# EAGLE design AD725_NTSC_Encoder (EAGLE 5.08)
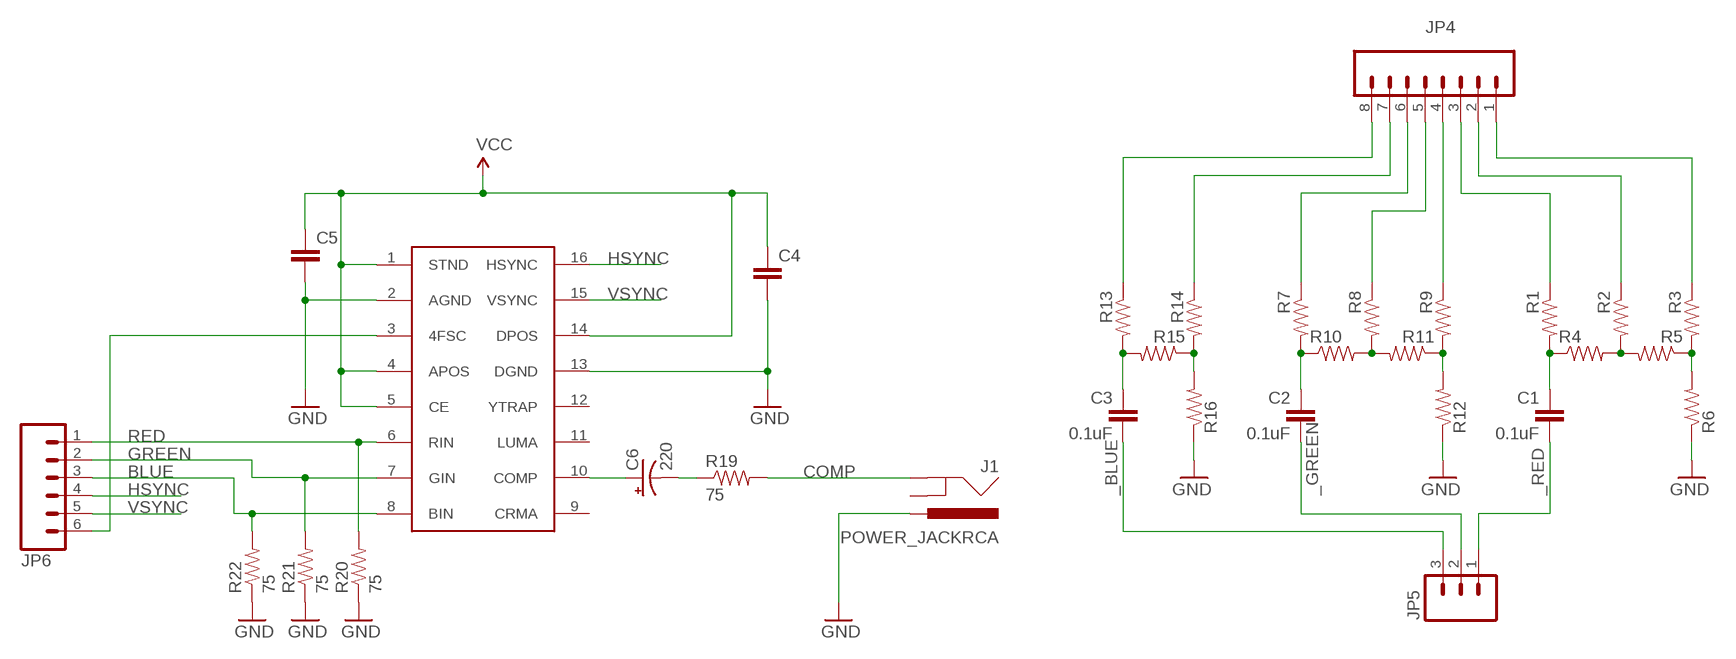
[diagram p0: schematic, sheet 1]

## Parts
C1  0.1uF  CAP0805  [0805]
C2  0.1uF  CAP0805  [0805]
C3  0.1uF  CAP0805  [0805]
C4  CAP0805  [0805]
C5  CAP0805  [0805]
C6  220  CAP_POLPTH1  [CPOL-RADIAL-100UF-25V]
J1  POWER_JACKRCA  [RCA]
JP4  M08  [1X08]
JP5  M03PTH  [1X03]
JP6  M06SIP  [1X06]
R1  RESISTOR1206  [1206]
R2  RESISTOR1206  [1206]
R3  RESISTOR1206  [1206]
R4  RESISTOR1206  [1206]
R5  RESISTOR1206  [1206]
R6  RESISTOR1206  [1206]
R7  RESISTOR1206  [1206]
R8  RESISTOR1206  [1206]
R9  RESISTOR1206  [1206]
R10  RESISTOR1206  [1206]
R11  RESISTOR1206  [1206]
R12  RESISTOR1206  [1206]
R13  RESISTOR1206  [1206]
R14  RESISTOR1206  [1206]
R15  RESISTOR1206  [1206]
R16  RESISTOR1206  [1206]
R19  75  RESISTOR1206  [1206]
R20  75  RESISTOR1206  [1206]
R21  75  RESISTOR1206  [1206]
R22  75  RESISTOR1206  [1206]
U$3  AD725  [SO16W]

## Nets
_BLUE: C3.2 JP5.3
_GREEN: C2.2 JP5.2
_RED: C1.2 JP5.1
B0: JP4.7 R14.1
B1: JP4.8 R13.1
BLUE: JP6.3 R22.2 U$3.8(BIN)
COMP: J1.BARREL(GND) R19.2
G0: JP4.4 R9.1
G1: JP4.5 R8.1
G2: JP4.6 R7.1
GND: C4.2 C5.2 J1.BREAK(PWR) R6.1 R12.1 R16.1 R20.1 R21.1 R22.1 U$3.2(AGND) U$3.13(DGND)
GREEN: JP6.2 R21.2 U$3.7(GIN)
HSYNC: JP6.4 U$3.16(HSYNC)
N$1: C1.1 R1.2 R4.1
N$2: R2.2 R4.2 R5.2
N$3: R3.2 R5.1 R6.2
N$4: C2.1 R7.2 R10.1
N$5: R8.2 R10.2 R11.2
N$6: R9.2 R11.1 R12.2
N$7: C3.1 R13.2 R15.2
N$8: R14.2 R15.1 R16.2
N$9: C6.1(+) U$3.10(COMP)
N$12: C6.2(-) R19.1
N$13: JP6.6 U$3.3(4FSC)
R0: JP4.1 R3.1
R1: JP4.2 R2.1
R2: JP4.3 R1.1
RED: JP6.1 R20.2 U$3.6(RIN)
VCC: C4.1 C5.1 U$3.1(STND) U$3.4(APOS) U$3.5(CE) U$3.14(DPOS)
VSYNC: JP6.5 U$3.15(VSYNC)
Unconnected: J1.SPRING(GNDBREAK) U$3.9(CRMA) U$3.11(LUMA) U$3.12(YTRAP)

## Library data of the parts
C1-C5 = SparkFun:CAP: Capacitor Standard 0603 ceramic capacitor, and 0.1" leaded capacitor.
C6 = SparkFun:CAP_POL: Capacitor Polarized These are standard SMD and PTH capacitors. Normally 10uF, 47uF, and 100uF in electrolytic and tantalum varieties. Always verify the external diameter of the through hole cap, it varies with capacity, voltage, and manufacturer. The EIA devices should be standard.
J1 = SparkFun:POWER_JACK: Power Jack This is the standard 5.5mm barrel jack for power. The PTH is the most common, proven, reliable, footprint. All others are experimental. The Slot footprint only works if the mill layer is transmitted to the PCB fab house so be warned. Spark Fun Electronics SKU : PRT-00119. Mating wall wart : TOL-00298 (and others)
JP4 = SparkFun:M08: Header 8 Standard 8-pin 0.1" header. Use with straight break away headers (SKU : PRT-00116), right angle break away headers (PRT-00553), swiss pins (PRT-00743), machine pins (PRT-00117), and female headers (PRT-00115).
JP5 = SparkFun:M03: Header 3 Standard 3-pin 0.1" header. Use with straight break away headers (SKU : PRT-00116), right angle break away headers (PRT-00553), swiss pins (PRT-00743), machine pins (PRT-00117), and female headers (PRT-00115). Molex polarized connector foot print use with SKU : PRT-08232 with associated crimp pins and housings.
JP6 = SparkFun:M06: Header 6 Standard 6-pin 0.1" header. Use with straight break away headers (SKU : PRT-00116), right angle break away headers (PRT-00553), swiss pins (PRT-00743), machine pins (PRT-00117), and female headers (PRT-00115). Molex polarized connector foot print use with SKU : PRT-08094 with associated crimp pins and housings. NOTES ON THE VARIANTS LOCK and LOCK_LONGPADS... This footprint was designed to help hold the alignment of a through-hole component (i.e. 6-pin header) while soldering it into place. You may notice that each hole has been shifted either up or down by 0.005 of an inch from it's more standard position (which is a perfectly straight line). This slight alteration caused the pins (the squares in the middle) to touch the edges of the holes. Because they are alternating, it causes a "brace" to hold the component in place. 0.005 has proven to be the perfect amount of "off-center" position when using our standard breakaway headers. Although looks a little odd when you look at the bare footprint, once you have a header in there, the alteration is very hard to notice. Also, if you push a header all the way into place, it is covered up entirely on the bottom side. This idea of altering the position of holes to aid alignment will be further integrated into the Sparkfun Library for other footprints. It can help hold any component with 3 or more connection pins.
R1-R16 R19-R22 = SparkFun:RESISTOR: Resistor Basic schematic elements and footprints for 0603, 1206, and PTH 1/10th watt (small) resistors.
U$3 = Atari:AD725

## Board
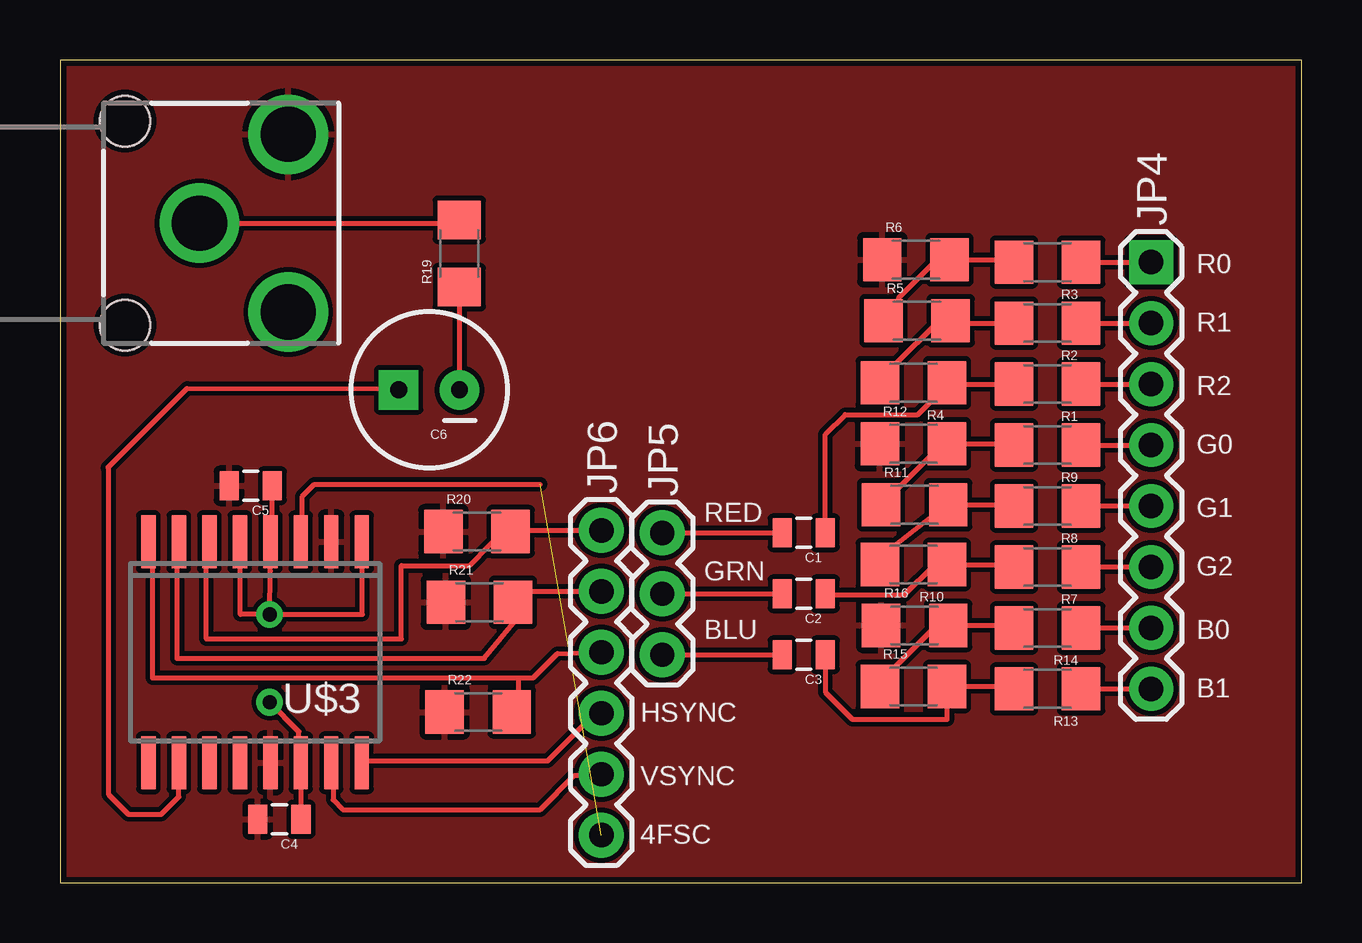
[diagram p1: board, top side]
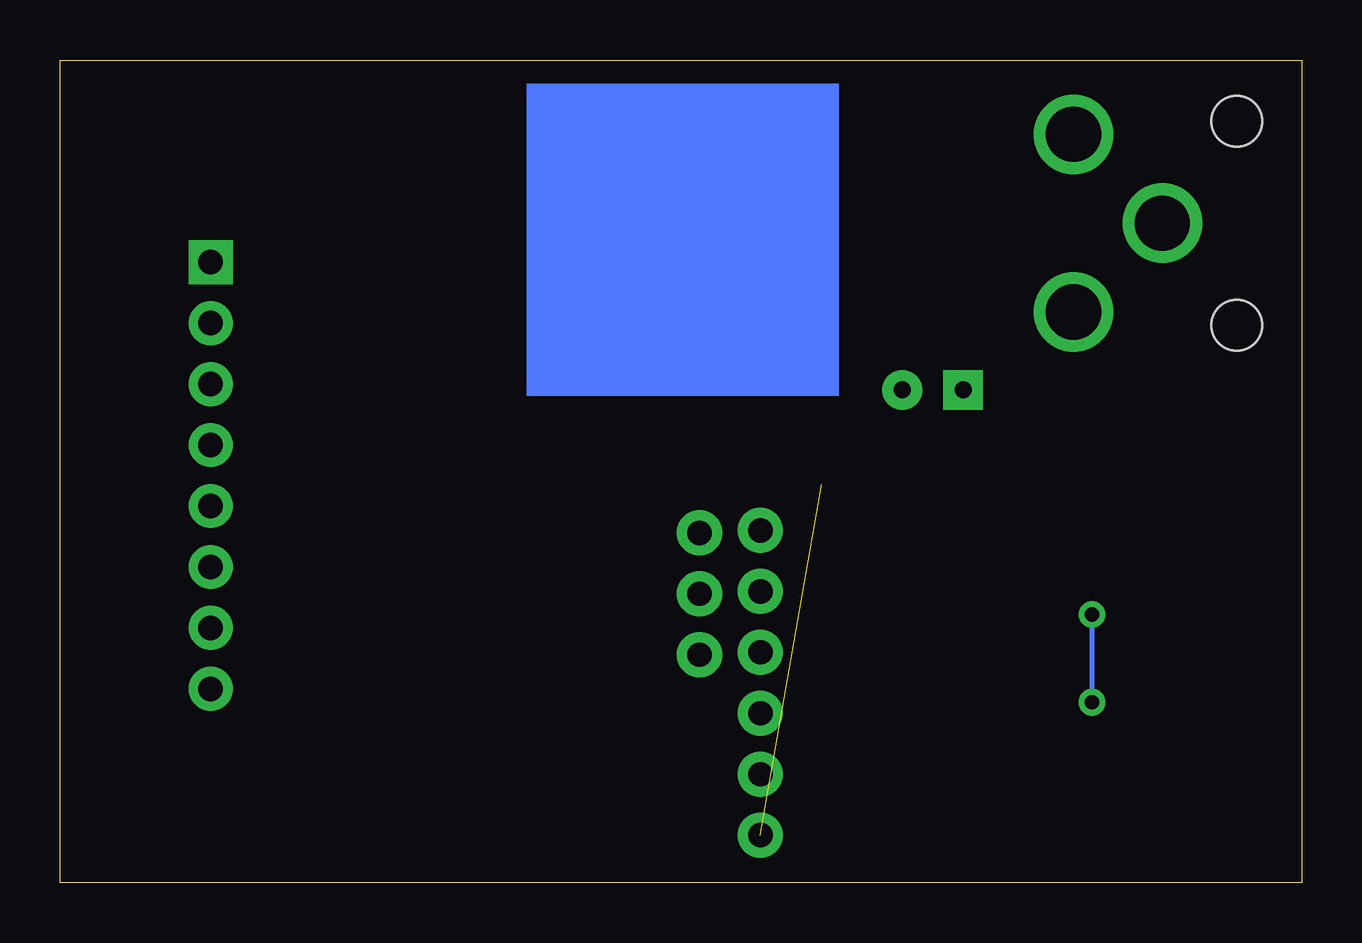
[diagram p2: board, bottom side, seen from below]

Size 51.74 x 34.28 mm. Coordinates in mm from the lower left corner, seen from the top.
Outline: 0,0 51.74,0 51.74,34.28 0,34.28 0,0
Copper layers (1*16): Top 0.035mm / dielectric 1.5mm / Bottom 0.035mm
Design rules "SparkFun": minimum track width 8mil, minimum drill 20mil, track to track 8mil, track to pad 8mil, pad to pad 8mil, via to via 8mil, smd to smd 8mil, copper to edge 10mil, drill to drill 8mil, minimum pad ring 12mil, minimum via ring 10mil, stop-mask expansion 4mil, vias tented up to drill 25mil, thermal gap 10mil

### Footprints (pad centres in the part's own frame; a part is rotated, then mirrored left to right if it is on the bottom)
0805 = smd 0.8 x 1.2: 1 -0.9,0; 2 0.9,0
CPOL-RADIAL-100UF-25V = drill 0.7 pad 1.651 square: 1 1.27,0 | drill 0.7 pad 1.651 round: 2 -1.27,0
RCA = drill 2.3 round: BARREL 0,0; BREAK 3.7,3.7; SPRING 3.7,-3.7 | hole 2.1: -3.1,4.25; -3.1,-4.25
1X08 = drill 1.016 pad 1.829 square: 1 0,0 | drill 1.016 pad 1.829 round: 2 2.54,0; 3 5.08,0; 4 7.62,0; 5 10.16,0; 6 12.7,0; 7 15.24,0; 8 17.78,0
1X03 = drill 1.016 pad 1.88 round: 1 0,0; 2 2.54,0; 3 5.08,0
1X06 = drill 1.016 pad 1.88 round: 1 0,0; 2 2.54,0; 3 5.08,0; 4 7.62,0; 5 10.16,0; 6 12.7,0
1206 = smd 1.6 x 1.8: 1 -1.4,0; 2 1.4,0
SO16W = smd 0.6 x 2.2: 1 -4.445,-4.6; 2 -3.175,-4.6; 3 -1.905,-4.6; 4 -0.635,-4.6; 5 0.635,-4.6; 6 1.905,-4.6; 7 3.175,-4.6; 8 4.445,-4.6; 9 4.445,4.6; 10 3.175,4.6; 11 1.905,4.6; 12 0.635,4.6; 13 -0.635,4.6; 14 -1.905,4.6; 15 -3.175,4.6; 16 -4.445,4.6

### Placement (x,y rotation side)
C1  30.99,14.58 180 top
C2  30.99,12.04 180 top
C3  30.99,9.5 180 top
C4  9.14,2.64 180 top
C5  7.95,16.54 180 top
C6  15.38,20.54 180 top
J1  5.81,27.48 0 top
JP4  45.47,25.86 270 top
JP5  25.1,14.58 270 top
JP6  22.56,14.68 270 top
R1  41.15,20.78 180 top
R2  41.15,23.32 180 top
R3  41.15,25.86 180 top
R4  35.56,20.83 180 top
R5  35.71,23.42 0 top
R6  35.66,25.96 0 top
R7  41.15,13.16 180 top
R8  41.15,15.7 180 top
R9  41.15,18.24 180 top
R10  35.56,13.26 180 top
R11  35.61,15.75 0 top
R12  35.56,18.29 0 top
R13  41.15,8.08 180 top
R14  41.15,10.62 180 top
R15  35.56,8.18 0 top
R16  35.61,10.72 0 top
R19  16.63,26.22 90 top
R20  17.37,14.63 0 top
R21  17.48,11.68 0 top
R22  17.42,7.11 0 top
U$3  8.13,9.6 180 top

### Tracks (layer width: path | path; a pad name or v marks a point on that pad's centre or on a via)
_BLUE
  Top 0.203: JP5.3 C3.2
_GREEN
  Top 0.203: JP5.2 C2.2
_RED
  Top 0.203: JP5.1 C1.2
B0
  Top 0.203: R14.1 JP4.7
B1
  Top 0.203: R13.1 JP4.8
BLUE
  Top 0.203: 3.86,14.22 3.86,8.53 19.1,8.53 | 19.1,8.53 19.71,8.53 20.73,9.55 JP6.3 | R22.2 19.1,7.52 19.1,8.53
  Top 0.254: 3.86,14.22 U$3.8
COMP
  Top 0.203: J1.BARREL 11.71,27.48 16.49,27.48 arc90 R19.2
G0
  Top 0.203: R9.1 JP4.4
G1
  Top 0.203: R8.1 JP4.5
G2
  Top 0.203: R7.1 JP4.6
GND
  pour Top: 0,0 0,34.34 51.82,34.34 51.82,0
GREEN
  Top 0.203: U$3.7 4.88,14.12 4.88,9.35 17.68,9.35 19.1,11.05 R21.2 19.15,11.96 19.15,12.14 | 19.15,12.14 JP6.2 | 19.15,12.14 arc-90 19.1,12.19
HSYNC
  Top 0.203: U$3.16 12.65,5.08 20.32,5.08 22.25,7.01 JP6.4
N$1
  Top 0.203: R1.2 37.01,20.78 arc-90 R4.1 36.96,20.73 35.74,19.51 32.72,19.51 31.89,18.68 C1.1
N$2
  Top 0.203: R2.2 37.21,23.32 arc-90 R5.2 36.63,23.42 34.75,21.54 34.14,21.54 34.14,20.85 R4.2
N$3
  Top 0.203: 39.83,25.86 R3.2 39.65,25.96 R6.2 36.52,25.96 34.95,24.38 34.95,24.18 34.34,24.18 arc90 34.31,24.15 R5.1 arc-90 34.26,23.47
N$4
  Top 0.203: R7.2 39.75,13.26 R10.1 36.45,13.26 35.18,11.99 32.11,11.99 32.05,11.84 C2.1
N$5
  Top 0.203: R8.2 39.75,15.75 R11.2 36.68,15.54 34.75,14.02 34.54,13.82 34.34,13.39 R10.2
N$6
  Top 0.203: 39.75,18.29 R9.2 39.7,18.29 R12.2 36.78,18.29 34.95,16.46 34.14,16.46 34.14,15.82 R11.1
N$7
  Top 0.203: R13.2 39.75,8.18 R15.2 36.96,6.81 33.02,6.81 31.89,7.94 C3.1
N$8
  Top 0.203: 39.75,10.72 R14.2 39.65,10.72 R16.2 36.52,10.72 34.75,8.94 34.14,8.94 34.14,8.2 R15.1
N$9
  Top 0.203: U$3.10 4.95,3.58 4.22,2.85 2.85,2.85 2.03,3.66 2.03,17.33 1.99,17.3 5.29,20.6 14.11,20.59 C6.1
N$12
  Top 0.203: C6.2 16.65,24.8 arc90 R19.1
N$13  (1 unrouted)
  Top 0.203: U$3.3 10.1,14.73 10.1,16.1 10.6,16.6 20,16.6
R0
  Top 0.203: R3.1 JP4.1
R1
  Top 0.203: R2.1 JP4.2
R2
  Top 0.203: R1.1 JP4.3
RED
  Top 0.203: U$3.6 6.1,13.92 6.1,10.16 14.22,10.16 14.22,13.21 17.07,13.21 18.77,14.96 R20.2 18.82,14.68 JP6.1 22.63,14.63
VCC  (via drill 0.6)
  Top 0.203: C5.1 8.85,14.29 U$3.4 8.76,12.98 v8.74,11.18 | C4.1 10.03,2.65 U$3.14 9.96,5.08 9.96,6.3 v8.74,7.52 | v8.74,11.18 12.6,11.18 12.6,14.18 U$3.1 | v8.74,11.18 7.52,11.18 7.52,14.18 U$3.5
  Bottom 0.203: v8.74,7.52 v8.74,11.18
VSYNC
  Top 0.203: U$3.15 11.38,5.08 11.38,3.45 11.79,3.05 20,3.05 21.43,4.47 22.76,4.47 22.76,4.39 JP6.5
(copper drawn outside any net)
  shapes: Bottom area x1

### Text on the board
tPlace: R0 | R1 | R2 | G0 | RED | G1 | GRN | G2 | BLU | B0 | B1 | HSYNC | VSYNC | 4FSC